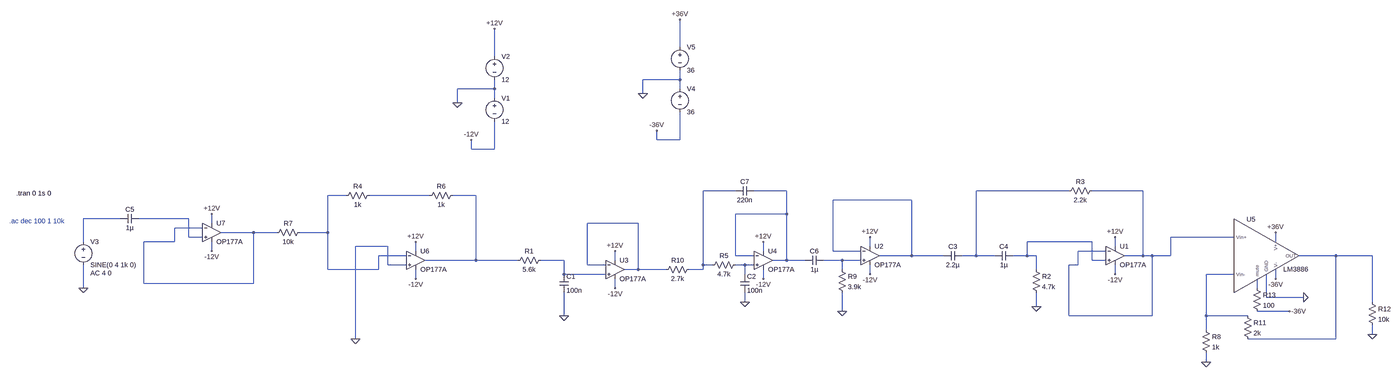
[diagram p0: schematic Wzmacniacz_empty.asc, whole sheet]
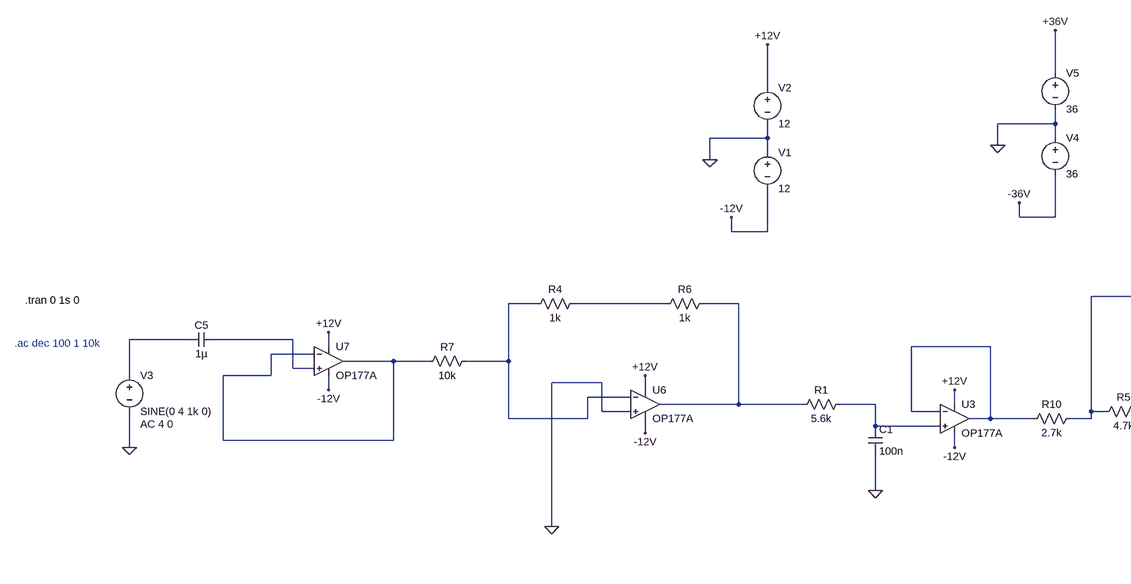
[diagram p1: schematic Wzmacniacz_empty.asc, part, row 1 of 1, column 1 of 2]
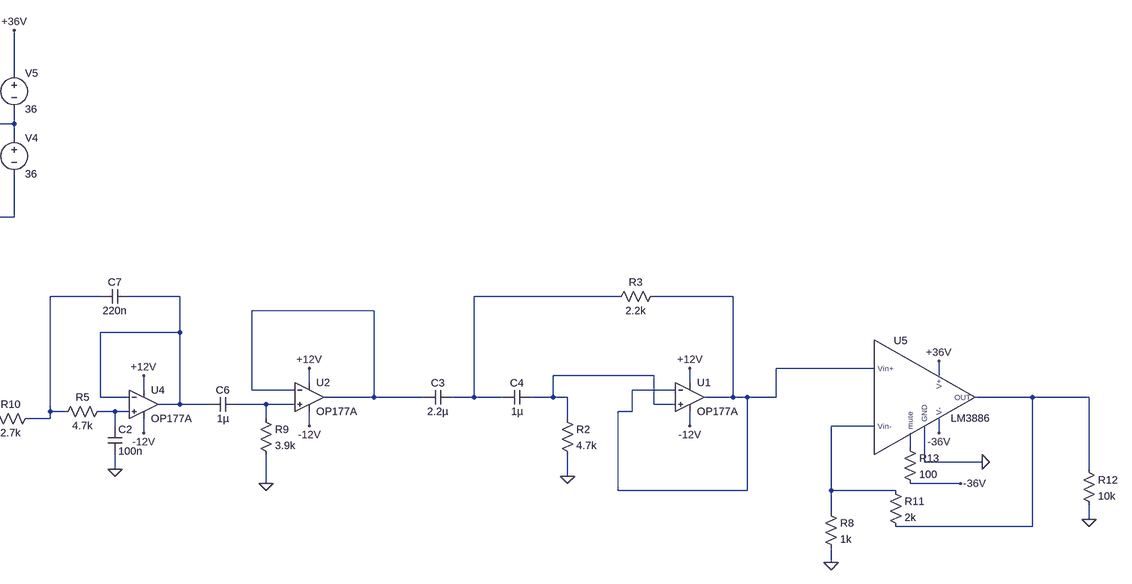
[diagram p2: schematic Wzmacniacz_empty.asc, part, row 1 of 1, column 2 of 2]
Wzmacniacz_empty.asc, the LTspice schematic file:
Version 4
SHEET 1 2548 820
WIRE -336 -752 -336 -848
WIRE -976 -720 -976 -816
WIRE -336 -640 -336 -672
WIRE -336 -640 -464 -640
WIRE -976 -608 -976 -640
WIRE -976 -608 -1104 -608
WIRE -336 -608 -336 -640
WIRE -464 -592 -464 -640
WIRE -976 -576 -976 -608
WIRE -1104 -560 -1104 -608
WIRE -416 -432 -416 -464
WIRE -336 -432 -336 -528
WIRE -336 -432 -416 -432
WIRE -1056 -400 -1056 -432
WIRE -976 -400 -976 -496
WIRE -976 -400 -1056 -400
WIRE -144 -64 -256 -64
WIRE 32 -64 -80 -64
WIRE 1088 -64 768 -64
WIRE 1344 -64 1168 -64
WIRE -1488 -48 -1552 -48
WIRE -1200 -48 -1408 -48
WIRE -1040 -48 -1120 -48
WIRE 464 -32 192 -32
WIRE 32 16 32 -64
WIRE 32 16 -144 16
WIRE -2272 32 -2400 32
WIRE -2032 32 -2208 32
WIRE -1952 48 -1952 16
WIRE -480 48 -656 48
WIRE -1984 64 -2080 64
WIRE -1808 80 -1920 80
WIRE -1728 80 -1808 80
WIRE -1552 80 -1552 -48
WIRE -1552 80 -1648 80
WIRE -2032 96 -2032 32
WIRE -1984 96 -2032 96
WIRE 1728 96 1440 96
WIRE -2400 112 -2400 32
WIRE -2080 112 -2080 64
WIRE -2080 112 -2192 112
WIRE 1168 112 944 112
WIRE 1872 112 1872 80
WIRE -1344 128 -1456 128
WIRE 320 128 320 96
WIRE 1248 128 1248 96
WIRE -1952 144 -1952 112
WIRE -1248 144 -1248 112
WIRE -48 144 -48 112
WIRE 192 144 192 -32
WIRE 288 144 192 144
WIRE 1216 144 1120 144
WIRE -1280 160 -1376 160
WIRE -144 160 -144 16
WIRE -80 160 -144 160
WIRE 464 160 464 -32
WIRE 464 160 352 160
WIRE 656 160 464 160
WIRE 768 160 768 -64
WIRE 768 160 720 160
WIRE 832 160 768 160
WIRE 944 160 944 112
WIRE 944 160 896 160
WIRE 976 160 944 160
WIRE 1344 160 1344 -64
WIRE 1344 160 1280 160
WIRE 1376 160 1344 160
WIRE 1440 160 1440 96
WIRE 1440 160 1376 160
WIRE 2080 160 1952 160
WIRE 2224 160 2080 160
WIRE -1040 176 -1040 -48
WIRE -1040 176 -1216 176
WIRE -896 176 -1040 176
WIRE -736 176 -816 176
WIRE -560 176 -560 144
WIRE 32 176 32 16
WIRE 32 176 -16 176
WIRE 96 176 32 176
WIRE 224 176 160 176
WIRE 288 176 224 176
WIRE 1168 176 1168 112
WIRE 1216 176 1168 176
WIRE -1344 192 -1344 128
WIRE -1280 192 -1344 192
WIRE -656 192 -656 48
WIRE -592 192 -656 192
WIRE -256 192 -256 -64
WIRE -224 192 -256 192
WIRE -112 192 -144 192
WIRE -80 192 -112 192
WIRE 1120 192 1120 144
WIRE 1120 192 1088 192
WIRE -1552 208 -1552 80
WIRE -1376 208 -1376 160
WIRE -1376 208 -1552 208
WIRE -480 208 -480 48
WIRE -480 208 -528 208
WIRE -384 208 -480 208
WIRE -256 208 -256 192
WIRE -256 208 -304 208
WIRE 224 208 224 176
WIRE 976 208 976 160
WIRE -736 224 -736 176
WIRE -592 224 -736 224
WIRE -112 224 -112 192
WIRE 320 224 320 192
WIRE 1248 224 1248 192
WIRE 1728 224 1632 224
WIRE -1248 240 -1248 208
WIRE -48 240 -48 208
WIRE 1872 240 1872 208
WIRE -2192 256 -2192 112
WIRE -1808 256 -1808 80
WIRE -1808 256 -2192 256
WIRE -2400 272 -2400 192
WIRE -560 272 -560 240
WIRE 1808 272 1808 240
WIRE 1840 304 1840 224
WIRE 1968 304 1840 304
WIRE -112 320 -112 288
WIRE 2224 320 2224 160
WIRE 976 336 976 288
WIRE 224 352 224 288
WIRE 1920 352 1808 352
WIRE -736 368 -736 288
WIRE 1088 368 1088 192
WIRE 1376 368 1376 160
WIRE 1376 368 1088 368
WIRE 1632 368 1632 224
WIRE 1776 368 1632 368
WIRE 1632 416 1632 368
WIRE 2224 432 2224 400
WIRE -1456 448 -1456 128
WIRE 2080 448 2080 160
WIRE 2080 448 1776 448
WIRE 1632 528 1632 496
FLAG -1104 -560 0
FLAG -976 -816 +12V
FLAG -1056 -432 -12V
FLAG -2400 272 0
FLAG 976 336 0
FLAG 1248 224 -12V
FLAG 1248 96 +12V
FLAG -1248 240 -12V
FLAG -1248 112 +12V
FLAG -1952 144 -12V
FLAG -1952 16 +12V
FLAG -1456 448 0
FLAG 224 352 0
FLAG 320 224 -12V
FLAG 320 96 +12V
FLAG -560 272 -12V
FLAG -560 144 +12V
FLAG -48 240 -12V
FLAG -48 112 +12V
FLAG -112 320 0
FLAG -736 368 0
FLAG 1872 240 -36V
FLAG 1872 80 +36V
FLAG 1632 528 0
FLAG 2224 432 0
FLAG 1920 352 -36V
FLAG 1968 304 0
FLAG -464 -592 0
FLAG -336 -848 +36V
FLAG -416 -464 -36V
SYMBOL voltage -976 -592 R0
WINDOW 123 0 0 Left 0
WINDOW 39 0 0 Left 0
SYMATTR InstName V1
SYMATTR Value 12
SYMBOL voltage -976 -736 R0
WINDOW 123 0 0 Left 0
WINDOW 39 0 0 Left 0
SYMATTR InstName V2
SYMATTR Value 12
SYMBOL voltage -2400 96 R0
WINDOW 123 24 124 Left 2
WINDOW 39 0 0 Left 0
SYMATTR Value2 AC 4 0
SYMATTR InstName V3
SYMATTR Value SINE(0 4 1k 0)
SYMBOL cap 720 144 R90
WINDOW 0 0 32 VBottom 2
WINDOW 3 32 32 VTop 2
SYMATTR InstName C3
SYMATTR Value 2.2µ
SYMBOL cap 896 144 R90
WINDOW 0 0 32 VBottom 2
WINDOW 3 32 32 VTop 2
SYMATTR InstName C4
SYMATTR Value 1µ
SYMBOL res 960 192 R0
SYMATTR InstName R2
SYMATTR Value 4.7k
SYMBOL res 1184 -80 R90
WINDOW 0 0 56 VBottom 2
WINDOW 3 32 56 VTop 2
SYMATTR InstName R3
SYMATTR Value 2.2k
SYMBOL res -1392 -64 R90
WINDOW 0 0 56 VBottom 2
WINDOW 3 32 56 VTop 2
SYMATTR InstName R4
SYMATTR Value 1k
SYMBOL res -1104 -64 R90
WINDOW 0 0 56 VBottom 2
WINDOW 3 32 56 VTop 2
SYMATTR InstName R6
SYMATTR Value 1k
SYMBOL res -1632 64 R90
WINDOW 0 0 56 VBottom 2
WINDOW 3 32 56 VTop 2
SYMATTR InstName R7
SYMATTR Value 10k
SYMBOL cap -2208 16 R90
WINDOW 0 0 32 VBottom 2
WINDOW 3 32 32 VTop 2
SYMATTR InstName C5
SYMATTR Value 1µ
SYMBOL OpAmps\\OP177A 1248 96 R0
SYMATTR InstName U1
SYMBOL OpAmps\\OP177A -1248 112 R0
SYMATTR InstName U6
SYMBOL OpAmps\\OP177A -1952 16 R0
SYMATTR InstName U7
SYMBOL OpAmps\\OP177A 320 96 R0
SYMATTR InstName U2
SYMBOL res 208 192 R0
SYMATTR InstName R9
SYMATTR Value 3.9k
SYMBOL cap 160 160 R90
WINDOW 0 0 32 VBottom 2
WINDOW 3 32 32 VTop 2
SYMATTR InstName C6
SYMATTR Value 1µ
SYMBOL res -800 160 R90
WINDOW 0 0 56 VBottom 2
WINDOW 3 32 56 VTop 2
SYMATTR InstName R1
SYMATTR Value 5.6k
SYMBOL OpAmps\\OP177A -560 144 R0
SYMATTR InstName U3
SYMBOL OpAmps\\OP177A -48 112 R0
SYMATTR InstName U4
SYMBOL cap -752 224 R0
SYMATTR InstName C1
SYMATTR Value 100n
SYMBOL res -128 176 R90
WINDOW 0 0 56 VBottom 2
WINDOW 3 32 56 VTop 2
SYMATTR InstName R5
SYMATTR Value 4.7k
SYMBOL res -288 192 R90
WINDOW 0 0 56 VBottom 2
WINDOW 3 32 56 VTop 2
SYMATTR InstName R10
SYMATTR Value 2.7k
SYMBOL cap -128 224 R0
SYMATTR InstName C2
SYMATTR Value 100n
SYMBOL cap -80 -80 R90
WINDOW 0 0 32 VBottom 2
WINDOW 3 32 32 VTop 2
SYMATTR InstName C7
SYMATTR Value 220n
SYMBOL res 1616 400 R0
SYMATTR InstName R8
SYMATTR Value 1k
SYMBOL res 1760 352 R0
SYMATTR InstName R11
SYMATTR Value 2k
SYMBOL res 2208 304 R0
SYMATTR InstName R12
SYMATTR Value 10k
SYMBOL res 1792 256 R0
SYMATTR InstName R13
SYMATTR Value 100
SYMBOL LM3886 1840 176 R0
SYMATTR InstName U5
SYMBOL voltage -336 -624 R0
WINDOW 123 0 0 Left 0
WINDOW 39 0 0 Left 0
SYMATTR InstName V4
SYMATTR Value 36
SYMBOL voltage -336 -768 R0
WINDOW 123 0 0 Left 0
WINDOW 39 0 0 Left 0
SYMATTR InstName V5
SYMATTR Value 36
TEXT -2632 -56 Left 2 !.tran 0 1s 0
TEXT -2656 40 Left 2 ;.ac dec 100 1 10k

The netlist it stands for:
* Wzmacniacz_empty.asc
V1 0 -12V 12
V2 +12V 0 12
V3 N009 0 SINE(0 4 1k 0) AC 4 0
C3 N003 N008 2.2µ
C4 N013 N003 1µ
R2 N013 0 4.7k
R3 N004 N003 2.2k
R4 N006 N005 1k
R6 N007 N006 1k
R7 N005 N012 10k
C5 N010 N009 1µ
XU1 N013 N004 +12V -12V N004 OP177A  ; pins In+ In- V+ V- OUT
XU6 0 N005 +12V -12V N007 OP177A  ; pins In+ In- V+ V- OUT
XU7 N010 N012 +12V -12V N012 OP177A  ; pins In+ In- V+ V- OUT
XU2 N016 N008 +12V -12V N008 OP177A  ; pins In+ In- V+ V- OUT
R9 N016 0 3.9k
C6 N016 N002 1µ
R1 N015 N007 5.6k
XU3 N015 N011 +12V -12V N011 OP177A  ; pins In+ In- V+ V- OUT
XU4 N017 N002 +12V -12V N002 OP177A  ; pins In+ In- V+ V- OUT
C1 N015 0 100n
R5 N017 N001 4.7k
R10 N001 N011 2.7k
C2 N017 0 100n
C7 N002 N001 220n
R8 N018 0 1k
R11 N018 N014 2k
R12 N014 0 10k
R13 N019 -36V 100
XU5 N004 N018 N014 +36V -36V N019 0 LM3886  ; pins Vin+ Vin- OUT V+ V- mute GND
V4 0 -36V 36
V5 +36V 0 36
.tran 0 1s 0
* .ac dec 100 1 10k
.lib C:\Users\Marek\Desktop\Projekt_Wzmacniacza_GrupaI\LTspice\LM3886.lib
.backanno
.end